# Altium schematic sheet Sheet1.SchDoc
size A4
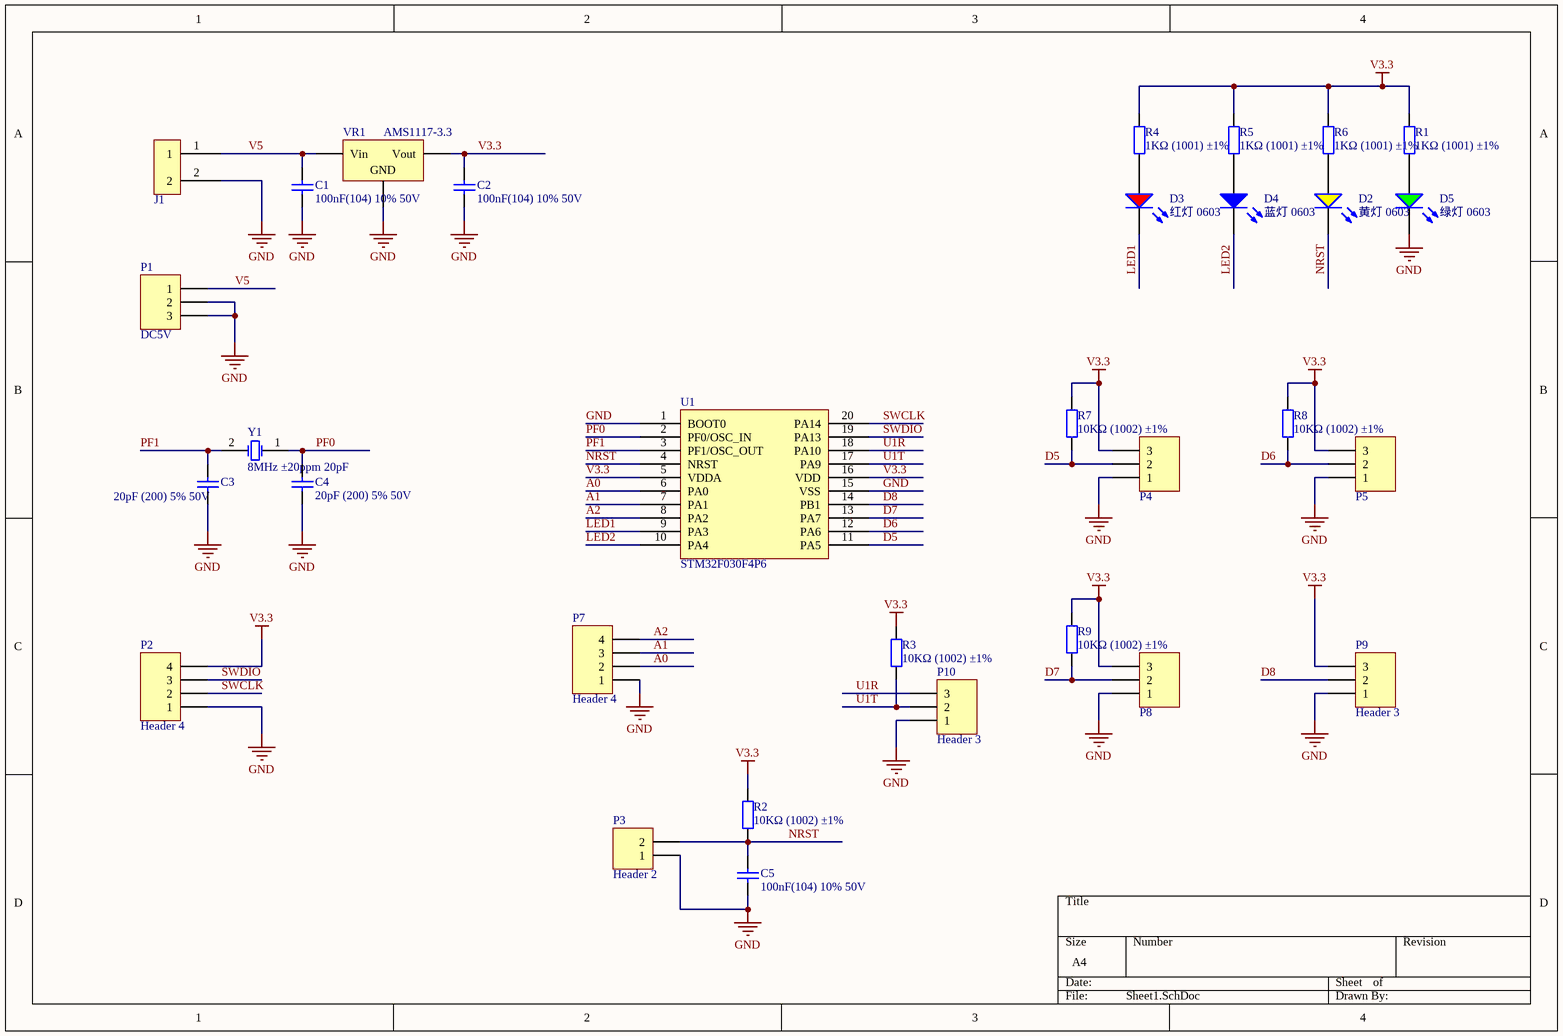
[diagram p0: Sheet1.SchDoc]

## Parts
C1  100nF(104) 10% 50V  [0805_C]
C2  100nF(104) 10% 50V  [0805_C]
C3  20pF (200) 5% 50V  [0805_C]
C4  20pF (200) 5% 50V  [0805_C]
C5  100nF(104) 10% 50V  [0805_C]
D2  黄灯 0603  [0603_LED_S1]
D3  红灯 0603  [0603_LED_S1]
D4  蓝灯 0603  [0603_LED_S1]
D5  绿灯 0603  [0603_LED_S1]
J1  XK7.62-2P  [XK7.62-2P]  (value not drawn)
P1  DC5V  [DC005]
P2  Header 4  [HDR1X4]
P3  Header 2  [HDR1X2]
P4  Header 3  [HDR1X3]  (value not drawn)
P5  Header 3  [HDR1X3]  (value not drawn)
P7  Header 4  [HDR1X4]
P8  Header 3  [HDR1X3]  (value not drawn)
P9  Header 3  [HDR1X3]
P10  Header 3  [HDR1X3]
R1  1KΩ (1001) ±1%  [0805_R]
R2  10KΩ (1002) ±1%  [0805_R]
R3  10KΩ (1002) ±1%  [0805_R]
R4  1KΩ (1001) ±1%  [0805_R]
R5  1KΩ (1001) ±1%  [0805_R]
R6  1KΩ (1001) ±1%  [0805_R]
R7  10KΩ (1002) ±1%  [0805_R]
R8  10KΩ (1002) ±1%  [0805_R]
R9  10KΩ (1002) ±1%  [0805_R]
U1  STM32F030F4P6  [TSSOP-20]
VR1  AMS1117-3.3  [SOT-223]
Y1  8MHz ±20ppm 20pF  [SMD-5032_2P]

## Nets
GND: C1.1 C2.1 C3.1 C4.1 C5.1 D5.K J1.2 P1.2 P1.3 P2.1 P3.1 P4.1 P5.1 P7.1 P8.1 P9.1 P10.1 U1.1(BOOT0) U1.15(VSS) VR1.1(GND)
V3.3: C2.2 P2.4 P4.3 P5.3 P8.3 P9.3 R1.2 R2.2 R3.2 R4.2 R5.2 R6.2 R7.2 R8.2 R9.2 U1.5(VDDA) U1.16(VDD) VR1.2(Vout)
A0: P7.2 U1.6(PA0)
A1: P7.3 U1.7(PA1)
A2: P7.4 U1.8(PA2)
D5: P4.2 R7.1 U1.11(PA5)
D6: P5.2 R8.1 U1.12(PA6)
D7: P8.2 R9.1 U1.13(PA7)
D8: P9.2 U1.14(PB1)
LED1: D3.K U1.9(PA3)
LED2: D4.K U1.10(PA4)
NRST: C5.2 D2.K P3.2 R2.1 U1.4(NRST)
PF0: C4.2 U1.2(PF0/OSC_IN) Y1.1(OSC1)
PF1: C3.2 U1.3(PF1/OSC_OUT) Y1.2(OSC2)
SWCLK: P2.2 U1.20(PA14)
SWDIO: P2.3 U1.19(PA13)
U1R: P10.3 U1.18(PA10)
U1T: P10.2 R3.1 U1.17(PA9)
V5: C1.2 J1.1 P1.1 VR1.3(Vin)
NetD2_A: D2.A R6.1
NetD3_A: D3.A R4.1
NetD4_A: D4.A R5.1
NetD5_A: D5.A R1.1

## Library data of the parts
C1 C2 C5 = 0805 100nF(104) 10% 50V: 贴片电容; ComponentLink1Description: 供应商链接; ComponentLink1URL: http://www.szlcsc.com/product/details_50686.html; Package: 0805; Supplier: LC; SuppliersPartNumber: C49678
C3 C4 = 0805 20pF (200) 5% 50V: 贴片电容; ComponentLink1Description: 供应商链接; ComponentLink1URL: http://www.szlcsc.com/product/details_2150.html; Package: 0805; Supplier: LC; SuppliersPartNumber: C1798
D2 = 0603 黄灯: 发光二极管; ComponentLink1Description: 供应商链接; ComponentLink1URL: http://www.szlcsc.com/product/details_73147.html; Package: 0603; Supplier: LC; SuppliersPartNumber: C72038
D3 = 0603 红灯: 发光二极管; ComponentLink1Description: 供应商链接; ComponentLink1URL: http://www.szlcsc.com/product/details_2659.html; Package: 0603; Supplier: LC; SuppliersPartNumber: C2286
D4 = 0603 蓝灯: 发光二极管; ComponentLink1Description: 供应商链接; ComponentLink1URL: http://www.szlcsc.com/product/details_73150.html; Package: 0603; Supplier: LC; SuppliersPartNumber: C72041
D5 = 0603 绿灯: 发光二极管; ComponentLink1Description: 供应商链接; ComponentLink1URL: http://www.szlcsc.com/product/details_73152.html; Package: 0603; Supplier: LC; SuppliersPartNumber: C72043
P1 P4 P5 P8-P10 = Header 3: Header, 3-Pin; LatestRevisionDate: 17-Jul-2002; LatestRevisionNote: Re-released for DXP Platform.; Publisher: Altium Limited
P2 P7 = Header 4: Header, 4-Pin; LatestRevisionDate: 17-Jul-2002; LatestRevisionNote: Re-released for DXP Platform.; Publisher: Altium Limited
P3 = Header 2: Header, 2-Pin; LatestRevisionDate: 17-Jul-2002; LatestRevisionNote: Re-released for DXP Platform.; Publisher: Altium Limited
R1 R4-R6 = 0805 1KΩ (1001) 1%: 贴片电阻; ComponentLink1Description: 供应商链接; ComponentLink1URL: http://www.szlcsc.com/product/details_18201.html; Package: 0805; Supplier: LC; SuppliersPartNumber: C17513
R2 R3 R7-R9 = 0805 10KΩ (1002) 1%: 贴片电阻; ComponentLink1Description: 供应商链接; ComponentLink1URL: http://www.szlcsc.com/product/details_18102.html; Package: 0805; Supplier: LC; SuppliersPartNumber: C17414
U1 = STM32F030F4P6: ARM; ComponentLink1Description: 供应商链接; ComponentLink1URL: http://www.szlcsc.com/product/details_33873.html; Package: TSSOP-20; Supplier: LC; SuppliersPartNumber: C32908
VR1 = SOT-223 AMS1117-3.3: 低压差线性稳压(LDO); ComponentLink1Description: 供应商链接; ComponentLink1URL: http://www.szlcsc.com/product/details_6652.html; Package: SOT-223; Supplier: LC; SuppliersPartNumber: C6186
Y1 = SMD-5032_2P 8MHz 20ppm 20pF: 贴片晶振; ComponentLink1Description: 供应商链接; ComponentLink1URL: http://www.szlcsc.com/product/details_117214.html; Package: SMD-5032_2P; Supplier: LC; SuppliersPartNumber: C115962